# EAGLE design esp32cam (EAGLE 9.6.2)
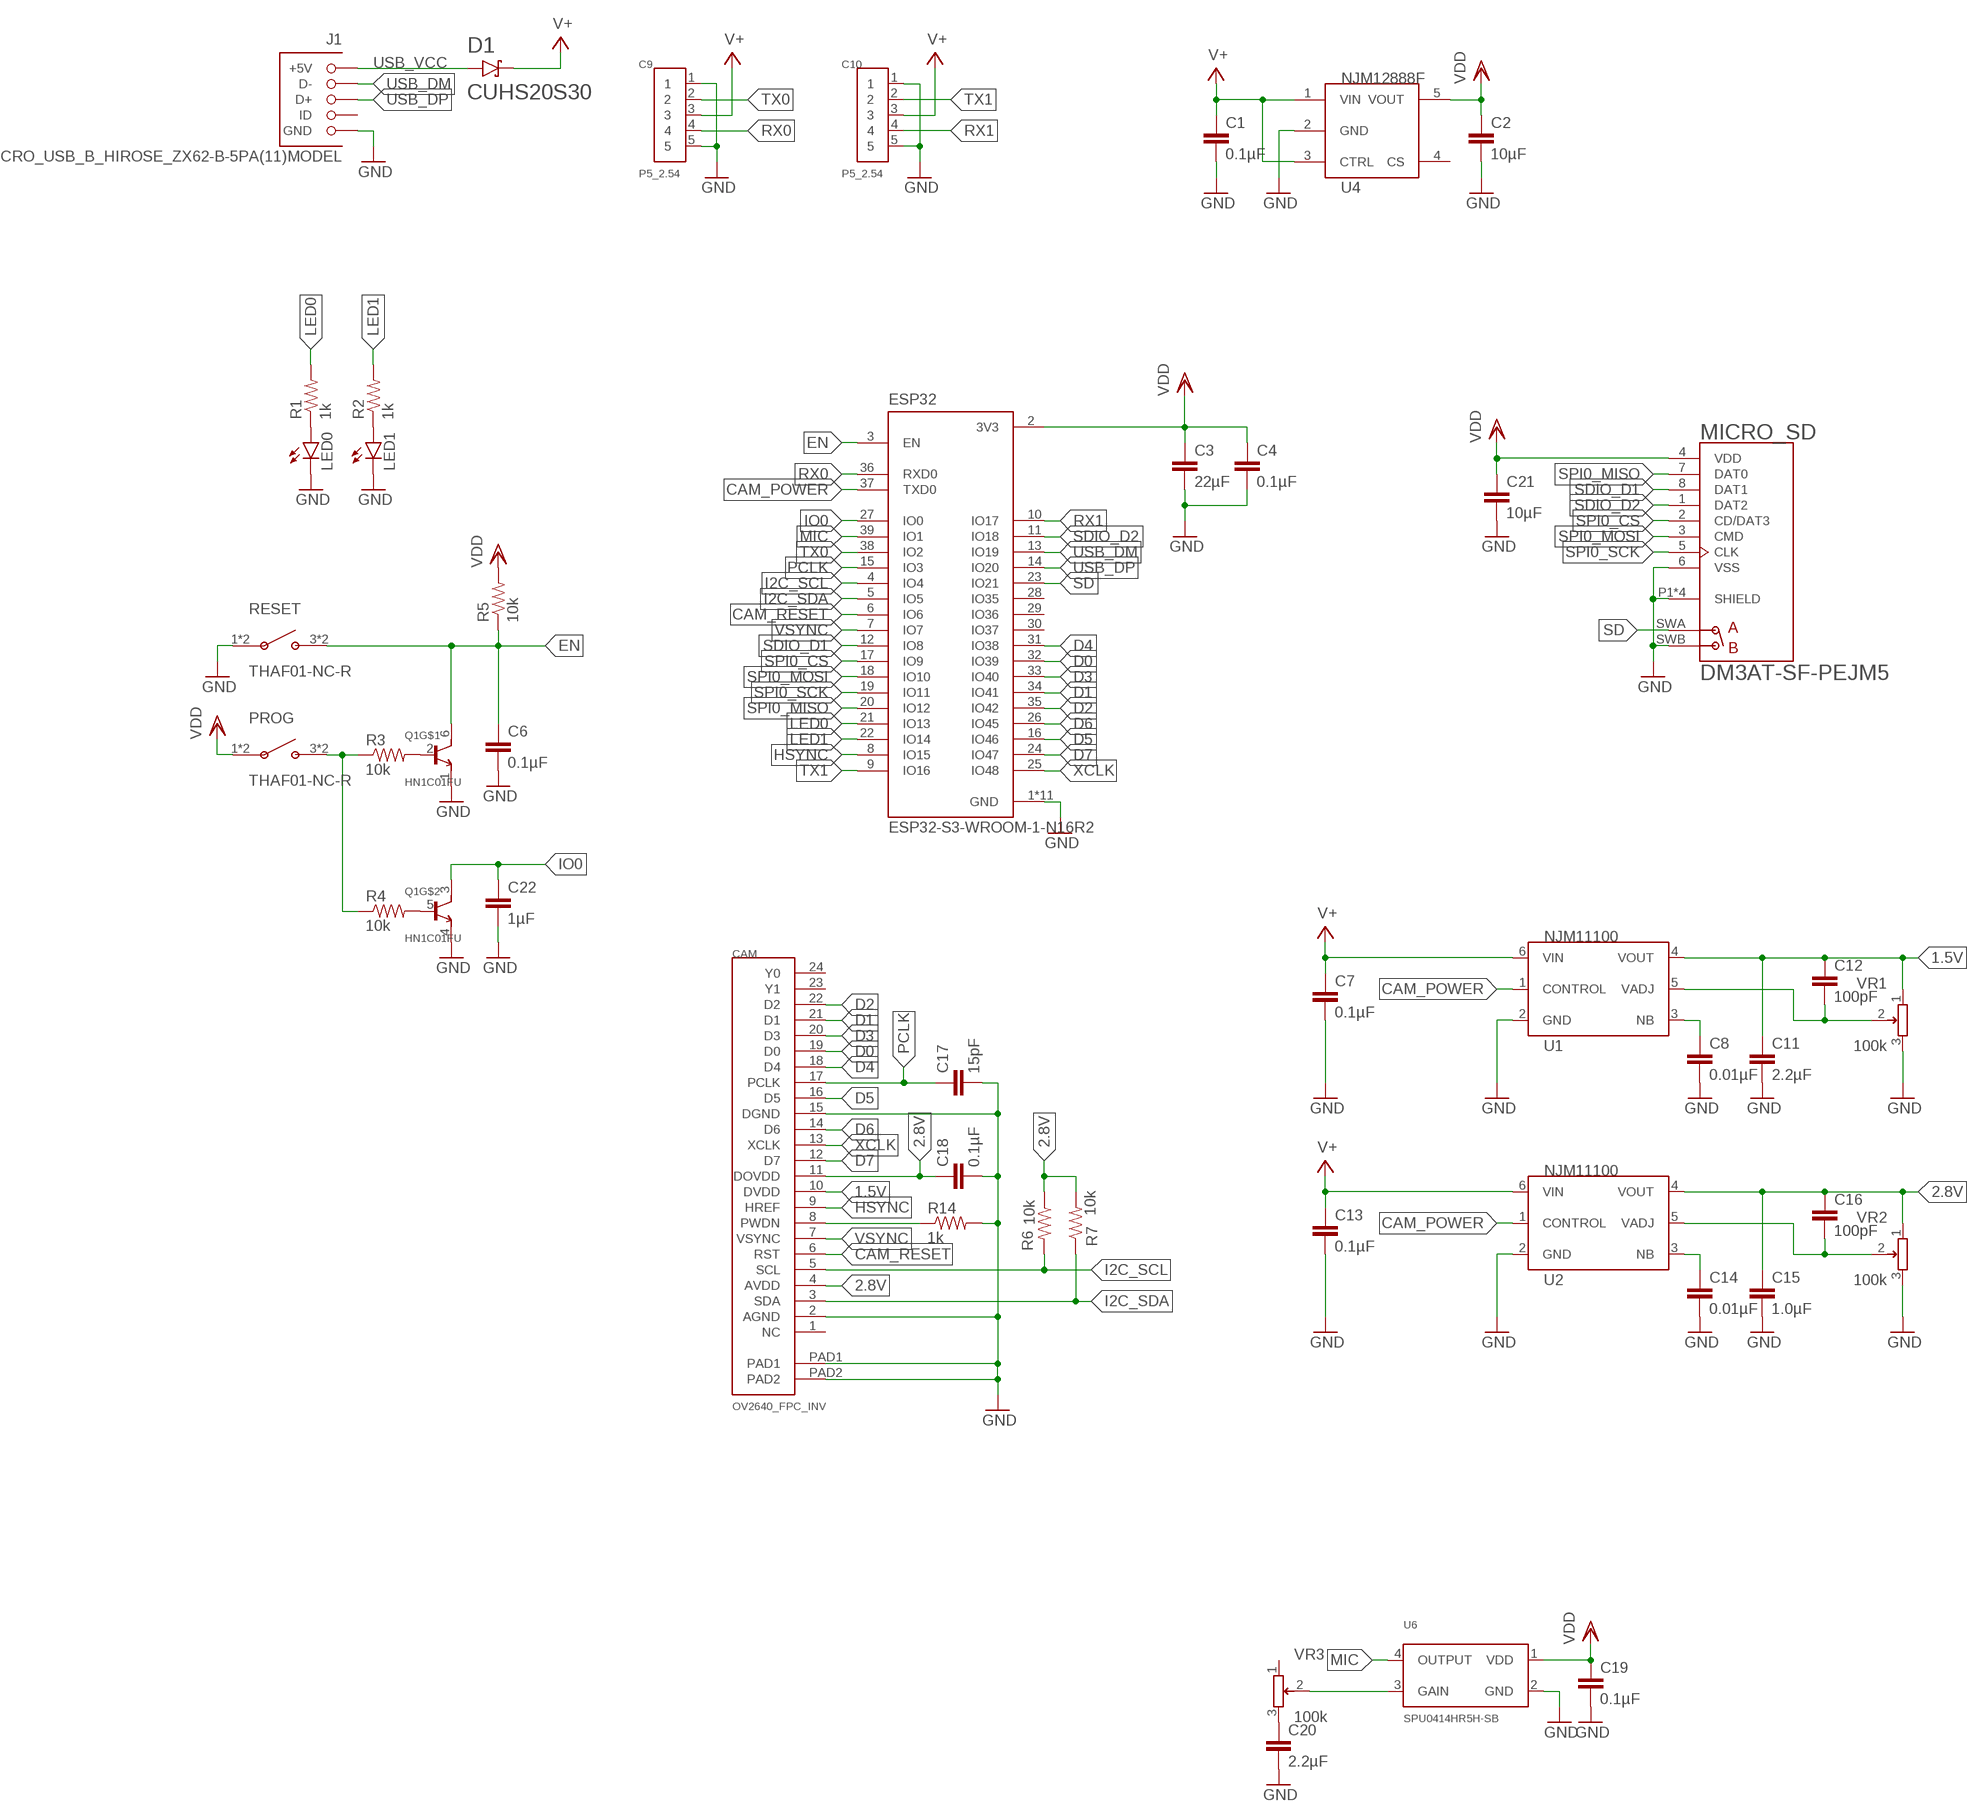
[diagram p0: schematic, sheet 1]

## Parts
C1  0.1µF  C-EUC0402  [C0402]
C2  10µF  C-EUC0402  [C0402]
C3  22µF  C-EUC0402  [C0402]
C4  0.1µF  C-EUC0402  [C0402]
C6  0.1µF  C-EUC0402  [C0402]
C7  0.1µF  C-EUC0402  [C0402]
C8  0.01µF  C-EUC0402  [C0402]
C9  P5_2.54  [P5_2.54]
C10  P5_2.54  [P5_2.54]
C11  2.2µF  C-EUC0402  [C0402]
C12  100pF  C-EUC0402  [C0402]
C13  0.1µF  C-EUC0402  [C0402]
C14  0.01µF  C-EUC0402  [C0402]
C15  1.0µF  C-EUC0402  [C0402]
C16  100pF  C-EUC0402  [C0402]
C17  15pF  C-EUC0402  [C0402]
C18  0.1µF  C-EUC0402  [C0402]
C19  0.1µF  C-EUC0402  [C0402]
C20  2.2µF  C-EUC0402  [C0402]
C21  10µF  C-EUC0402  [C0402]
C22  1µF  C-EUC0402  [C0402]
CAM  OV2640_FPC_INV  [FH12-24S-0.5SH]
D1  CUHS20S30  [CUHS20S30]
ESP32  ESP32-S3-WROOM-1-N16R2  [XCVR_ESP32-S3-WROOM-1-N16R2]
J1  MICRO_USB_B_HIROSE_ZX62-B-5PA(11)MODEL  [GHI-CONNECTORS_10118192-0001LF(MICRO-USB-B-AMPHENOL-FCI)]
LED0  LEDCHIPLED_0603  [CHIPLED_0603]
LED1  LEDCHIPLED_0603  [CHIPLED_0603]
MICRO_SD  DM3AT-SF-PEJM5  [HRS_DM3AT-SF-PEJM5]
PROG  THAF01-NC-R  [THAF01-NC-R]
Q1  HN1C01FU  [SOT-363]
R1  1k  R-US_R0402  [R0402]
R2  1k  R-US_R0402  [R0402]
R3  10k  R-US_R0402  [R0402]
R4  10k  R-US_R0402  [R0402]
R5  10k  R-US_R0402  [R0402]
R6  10k  R-US_R0402  [R0402]
R7  10k  R-US_R0402  [R0402]
R14  1k  R-US_R0402  [R0402]
RESET  THAF01-NC-R  [THAF01-NC-R]
U1  NJM11100  [SOT95P240X110-6N]
U2  NJM11100  [SOT95P240X110-6N]
U4  NJM12888F  [SOT95P240X110-5N]
U6  SPU0414HR5H-SB  [SPU0414HR5H-SB]
VR1  100k  PVZ3A  [PVZ3A]
VR2  100k  PVZ3A  [PVZ3A]
VR3  100k  PVZ3A  [PVZ3A]

## Nets
1.5V: C11.1 C12.1 CAM.10(DVDD) U1.4(VOUT) VR1.1
2.8V: C15.1 C16.1 C18.1 CAM.4(AVDD) CAM.11(DOVDD) R6.1 R7.2 U2.4(VOUT) VR2.1
CAM_POWER: ESP32.37(TXD0) U1.1(CONTROL) U2.1(CONTROL)
CAM_RESET: CAM.6(RST) ESP32.6(IO6)
D0: CAM.19(D0) ESP32.32(IO39)
D1: CAM.21(D1) ESP32.34(IO41)
D2: CAM.22(D2) ESP32.35(IO42)
D3: CAM.20(D3) ESP32.33(IO40)
D4: CAM.18(D4) ESP32.31(IO38)
D5: CAM.16(D5) ESP32.16(IO46)
D6: CAM.14(D6) ESP32.26(IO45)
D7: CAM.12(D7) ESP32.24(IO47)
EN: C6.1 ESP32.3(EN) Q1.6(C) R5.1 RESET.3(B) RESET.4(B)
GND: C1.2 C2.2 C3.2 C4.2 C6.2 C7.2 C8.2 C9.1 C9.5 C10.1 C10.5 C11.2 C13.2 C14.2 C15.2 C17.2 C18.2 C19.2 C20.2 C21.2 C22.2 CAM.2(AGND) CAM.15(DGND) CAM.PAD1 CAM.PAD2 ESP32.1(GND) ESP32.40(GND) ESP32.41_1(GND) ESP32.41_2(GND) ESP32.41_3(GND) ESP32.41_4(GND) ESP32.41_5(GND) ESP32.41_6(GND) ESP32.41_7(GND) ESP32.41_8(GND) ESP32.41_9(GND) J1.CGND1(GND) J1.CGND2(GND) J1.CGND3(GND) J1.CGND4(GND) J1.CGND5(GND) J1.CGND6(GND) J1.GND LED0.C LED1.C MICRO_SD.6(VSS) MICRO_SD.P1(SHIELD) MICRO_SD.P2(SHIELD) MICRO_SD.P3(SHIELD) MICRO_SD.P4(SHIELD) MICRO_SD.SWB(B) Q1.1(E) Q1.4(E) R14.2 RESET.1(A) RESET.2(A) U1.2(GND) U2.2(GND) U4.2(GND) U6.2(GND) VR1.3 VR2.3
HSYNC: CAM.9(HREF) ESP32.8(IO15)
I2C_SCL: CAM.5(SCL) ESP32.4(IO4) R6.2
I2C_SDA: CAM.3(SDA) ESP32.5(IO5) R7.1
IO0: C22.1 ESP32.27(IO0) Q1.3(C)
LED0: ESP32.21(IO13) R1.2
LED1: ESP32.22(IO14) R2.2
MIC: ESP32.39(IO1) U6.4(OUTPUT)
N$1: C8.1 U1.3(NB)
N$2: C12.2 U1.5(VADJ) VR1.2
N$3: C14.1 U2.3(NB)
N$4: C16.2 U2.5(VADJ) VR2.2
N$5: PROG.3(B) PROG.4(B) R3.1 R4.1
N$7: LED0.A R1.1
N$8: LED1.A R2.1
N$9: Q1.2(B) R3.2
N$10: CAM.8(PWDN) R14.1
N$11: Q1.5(B) R4.2
N$13: U6.3(GAIN) VR3.2
N$14: C20.1 VR3.3
PCLK: C17.1 CAM.17(PCLK) ESP32.15(IO3)
RX0: C9.4 ESP32.36(RXD0)
RX1: C10.4 ESP32.10(IO17)
SD: ESP32.23(IO21) MICRO_SD.SWA(A)
SDIO_D1: ESP32.12(IO8) MICRO_SD.8(DAT1)
SDIO_D2: ESP32.11(IO18) MICRO_SD.1(DAT2)
SPI0_CS: ESP32.17(IO9) MICRO_SD.2(CD/DAT3)
SPI0_MISO: ESP32.20(IO12) MICRO_SD.7(DAT0)
SPI0_MOSI: ESP32.18(IO10) MICRO_SD.3(CMD)
SPI0_SCK: ESP32.19(IO11) MICRO_SD.5(CLK)
TX0: C9.2 ESP32.38(IO2)
TX1: C10.2 ESP32.9(IO16)
USB_DM: ESP32.13(IO19) J1.D-
USB_DP: ESP32.14(IO20) J1.D+
USB_VCC: D1.A J1.VBUS(+5V)
V+: C1.1 C7.1 C9.3 C10.3 C13.1 D1.C U1.6(VIN) U2.6(VIN) U4.1(VIN) U4.3(CTRL)
VDD: C2.1 C3.1 C4.1 C19.1 C21.1 ESP32.2(3V3) MICRO_SD.4(VDD) PROG.1(A) PROG.2(A) R5.2 U4.5(VOUT) U6.1(VDD)
VSYNC: CAM.7(VSYNC) ESP32.7(IO7)
XCLK: CAM.13(XCLK) ESP32.25(IO48)
Unconnected: CAM.1(NC) CAM.23(Y1) CAM.24(Y0) ESP32.28(IO35) ESP32.29(IO36) ESP32.30(IO37) J1.ID U4.4(CS) VR3.1

## Library data of the parts
C1-C4 C6-C8 C11-C22 = rcl:C-EU: CAPACITOR, European symbol; SPICEPREFIX: C
C9 C10 = pins:P5_2.54
CAM = camera:OV2640_FPC_INV
D1 = diodes:CUHS20S30
ESP32 = ESP32-S3-WROOM-1-N16R2:ESP32-S3-WROOM-1-N16R2: Check availability <https://pricing.snapeda.com/parts/ESP32-S3-WROOM-1-N16R2/Espressif%20Systems/view-part?ref=eda>; AVAILABILITY: In Stock; DESCRIPTION: Bluetooth, WiFi 802.11b/g/n, Bluetooth v5.0 Transceiver Module 2.4GHz PCB Trace Surface Mount; MF: Espressif Systems; MP: ESP32-S3-WROOM-1-N16R2; PACKAGE: None; PRICE: None; PURCHASE-URL: https://pricing.snapeda.com/search/part/ESP32-S3-WROOM-1-N16R2/?ref=eda
J1 = connector:MICRO_USB_B_HIROSE_ZX62-B-5PA(11): Connector Receptacle USB - micro B 2.0 5 Position Surface Mount, Right Angle, Horizontal Bottom Mount
LED0 LED1 = led:LED: LED OSRAM: - CHIPLED LG R971, LG N971, LY N971, LG Q971, LY Q971, LO R971, LY R971 LH N974, LH R974 LS Q976, LO Q976, LY Q976 LO Q996 - Hyper CHIPLED LW Q18S LB Q993, LB Q99A, LB R99A - SideLED LS A670, LO A670, LY A670, LG A670, LP A670 LB A673, LV A673, LT A673, LW A673 LH A674 LY A675 LS A676, LA A676, LO A676, LY A676, LW A676 LS A679, LY A679, LG A679 - Hyper Micro SIDELED® LS Y876, LA Y876, LO Y876, LY Y876 LT Y87S - SmartLED LW L88C, LW L88S LB L89C, LB L89S, LG L890 LS L89K, LO L89K, LY L89K LS L896, LA L896, LO L896, LY L896 - TOPLED LS T670, LO T670, LY T670, LG T670, LP T670 LSG T670, LSP T670, LSY T670, LOP T670, LYG T670 LG T671, LOG T671, LSG T671 LB T673, LV T673, LT T673, LW T673 LH T674 LS T676, LA T676, LO T676, LY T676, LB T676, LH T676, LSB T676, LW T676 LB T67C, LV T67C, LT T67C, LS T67K, LO T67K, LY T67K, LW E67C LS E67B, LA E67B, LO E67B, LY E67B, LB E67C, LV E67C, LT E67C LW T67C LS T679, LY T679, LG T679 LS T770, LO T770, LY T770, LG T770, LP T770 LB T773, LV T773, LT T773, LW T773 LH T774 LS E675, LA E675, LY E675, LS T675 LS T776, LA T776, LO T776, LY T776, LB T776 LHGB T686 LT T68C, LB T68C - Hyper Mini TOPLED® LB M676 - Mini TOPLED Santana® LG M470 LS M47K, LO M47K, LY M47K Source: http://www.osram.convergy.de LUXEON: - LUMILED® LXK2-PW12-R00, LXK2-PW12-S00, LXK2-PW14-U00, LXK2-PW14-V00 LXK2-PM12-R00, LXK2-PM12-S00, LXK2-PM14-U00 LXK2-PE12-Q00, LXK2-PE12-R00, LXK2-PE12-S00, LXK2-PE14-T00, LXK2-PE14-U00 LXK2-PB12-K00, LXK2-PB12-L00, LXK2-PB12-M00, LXK2-PB14-N00, LXK2-PB14-P00, LXK2-PB14-Q00 LXK2-PR12-L00, LXK2-PR12-M00, LXK2-PR14-Q00, LXK2-PR14-R00 LXK2-PD12-Q00, LXK2-PD12-R00, LXK2-PD12-S00 LXK2-PH12-R00, LXK2-PH12-S00 LXK2-PL12-P00, LXK2-PL12-Q00, LXK2-PL12-R00 Source: www.luxeon.com KINGBRIGHT: KA-3528ASYC Source: www.kingbright.com
MICRO_SD = dm3at-sf-pejm5:DM3AT-SF-PEJM5: DM3 Series 8 Position Right Angle SMT Push Push Ejection MicroSD Card Connector; DESCRIPTION: DM3 RA SMT microSD memory card push/push; DIGI-KEY_PART_NUMBER: HR1964CT-ND; DIGI-KEY_PURCHASE_URL: https://www.digikey.jp/product-detail/en/hirose-electric-co-ltd/DM3AT-SF-PEJM5/HR1964CT-ND/2533566?utm_source=snapeda&utm_medium=aggregator&utm_campaign=symbol; MF: Hirose; MP: DM3AT-SF-PEJM5; PACKAGE: None
PROG RESET = switches:THAF01-NC-R
Q1 = transistors:HN1C01FU
R1-R7 R14 = rcl:R-US_: RESISTOR, American symbol; SPICEPREFIX: R
U1 U2 = regulators:NJM11100
U4 = regulators:NJM12888F
U6 = microphones:SPU0414HR5H-SB
VR1-VR3 = potentiometers:PVZ3A

## Board
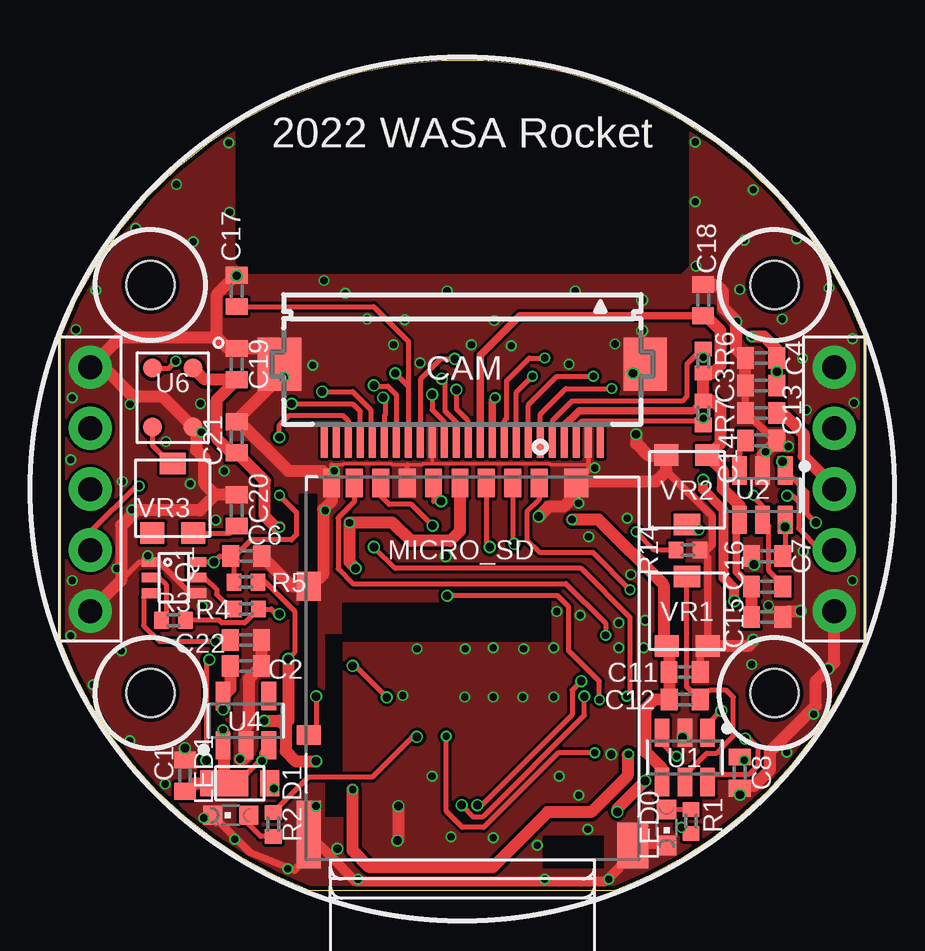
[diagram p1: board, top side]
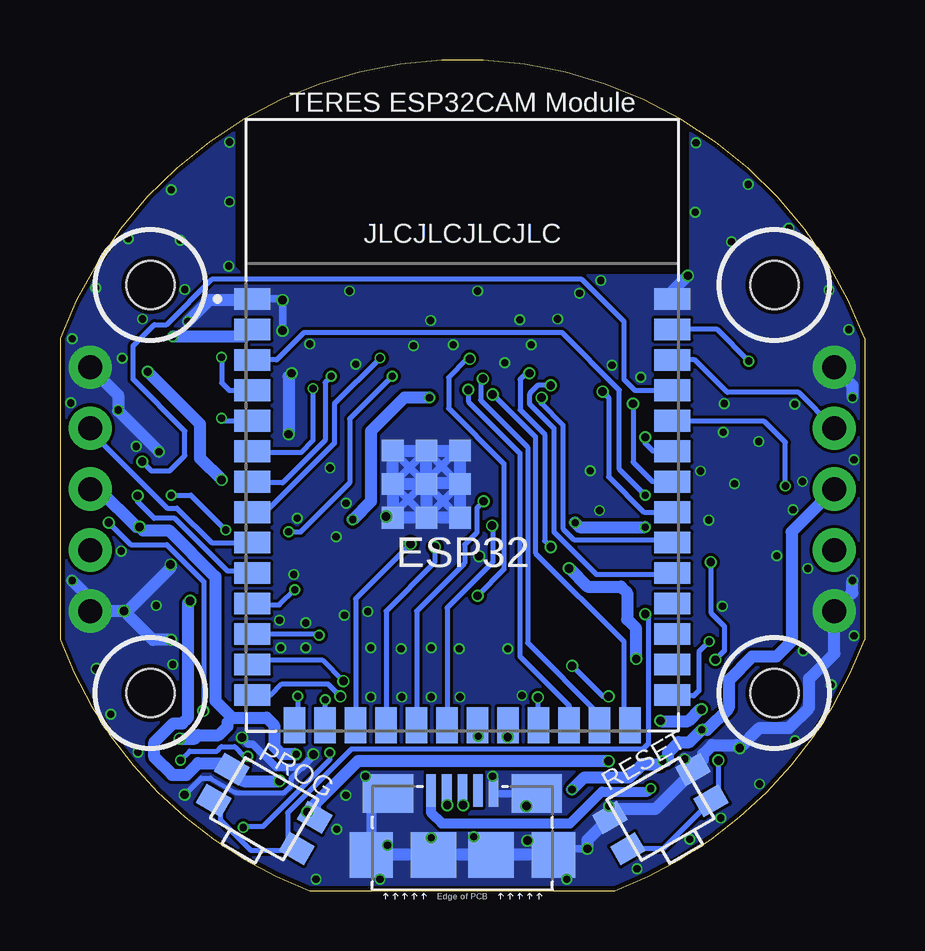
[diagram p2: board, bottom side, seen from below]

Size 33.53 x 34.61 mm. Coordinates in mm from the lower left corner, seen from the top.
Outline: 33.53,23.01 33.53,10.46 arc-49 23.11,0 10.41,0 arc-49 0,10.46 0,23.01 arc-139 33.53,23.01
Copper layers (1*16): Top 0.035mm / dielectric 1mm / Bottom 0.035mm
Design rules "jlcpcb-2layers-1.0mm": minimum track width 5mil, minimum drill 0.3mm, track to track 5mil, track to pad 5mil, pad to pad 5mil, via to via 5mil, smd to smd 5mil, copper to edge 0.2mm, drill to drill 6mil, minimum pad ring 10mil, minimum via ring 3mil, stop-mask expansion 4mil, vias tented up to drill 1mm, thermal gap 10mil
Holes 2 mm at 29.76,25.24 29.76,8.24 3.76,25.24 3.76,8.24

### Footprints (pad centres in the part's own frame; a part is rotated, then mirrored left to right if it is on the bottom)
C0402 = smd 0.7 x 0.9: 1 -0.65,0; 2 0.65,0
P5_2.54 = drill 1: 1 0,5.08; 2 0,2.54; 3 0,0; 4 0,-2.54; 5 0,-5.08
FH12-24S-0.5SH = smd 0.3 x 1.3: 1 -5.75,3.25; 2 -5.25,3.25; 3 -4.75,3.25; 4 -4.25,3.25; 5 -3.75,3.25; 6 -3.25,3.25; 7 -2.75,3.25; 8 -2.25,3.25; 9 -1.75,3.25; 10 -1.25,3.25; 11 -0.75,3.25; 12 -0.25,3.25; 13 0.25,3.25; 14 0.75,3.25; 15 1.25,3.25; 16 1.75,3.25; 17 2.25,3.25; 18 2.75,3.25; 19 3.25,3.25; 20 3.75,3.25; 21 4.25,3.25; 22 4.75,3.25; 23 5.25,3.25; 24 5.75,3.25 | smd 1.8 x 2.2: PAD1 -7.62,0; PAD2 7.62,0
CUHS20S30 = smd 0.8 x 1.1: A 1.25,0 | smd 2 x 1.1: C -0.65,0
XCVR_ESP32-S3-WROOM-1-N16R2 = smd 1.5 x 0.9: 1 -8.75,5.26; 2 -8.75,3.99; 3 -8.75,2.72; 4 -8.75,1.45; 5 -8.75,0.18; 6 -8.75,-1.09; 7 -8.75,-2.36; 8 -8.75,-3.63; 9 -8.75,-4.9; 10 -8.75,-6.17; 11 -8.75,-7.44; 12 -8.75,-8.71; 13 -8.75,-9.98; 14 -8.75,-11.25; 27 8.75,-11.25; 28 8.75,-9.98; 29 8.75,-8.71; 30 8.75,-7.44; 31 8.75,-6.17; 32 8.75,-4.9; 33 8.75,-3.63; 34 8.75,-2.36; 35 8.75,-1.09; 36 8.75,0.18; 37 8.75,1.45; 38 8.75,2.72; 39 8.75,3.99; 40 8.75,5.26 | smd 0.9 x 1.5: 15 -6.985,-12.5; 16 -5.715,-12.5; 17 -4.445,-12.5; 18 -3.175,-12.5; 19 -1.905,-12.5; 20 -0.635,-12.5; 21 0.635,-12.5; 22 1.905,-12.5; 23 3.175,-12.5; 24 4.445,-12.5; 25 5.715,-12.5; 26 6.985,-12.5 | smd 0.9 x 0.9: 41_1 -1.5,-2.46; 41_2 -2.9,-2.46; 41_3 -0.1,-2.46; 41_4 -2.9,-3.86; 41_5 -1.5,-3.86; 41_6 -0.1,-3.86; 41_7 -2.9,-1.06; 41_8 -1.5,-1.06; 41_9 -0.1,-1.06
GHI-CONNECTORS_10118192-0001LF(MICRO-USB-B-AMPHENOL-FCI) = smd 1.8 x 1.9: CGND1 -3.8,0; CGND4 3.8,0 | smd 1.9 x 1.9: CGND2 -1.2,0; CGND3 1.2,0 | smd 2.1 x 1.6: CGND5 3.1,2.55; CGND6 -3.1,2.55 | smd 0.4 x 1.35: D+ 0,2.675; D- -0.65,2.675; GND 1.3,2.675; ID 0.65,2.675; VBUS -1.3,2.675
CHIPLED_0603 = smd 0.8 x 0.8: A 0,-0.75; C 0,0.75
HRS_DM3AT-SF-PEJM5 = smd 0.7 x 1.2: 1 3.2,0; 2 2.1,0; 3 1,0; 4 -0.1,0; 5 -1.2,0; 6 -2.3,0; 7 -3.4,0; 8 -4.5,0; SWB -5.45,0 | smd 1 x 1.2: P1 -6.4,-4.3; P4 4.75,0 | smd 1 x 2.8: P2 -6.4,-14.65 | smd 1.3 x 1.9: P3 7.1,-15.1 | smd 1 x 0.8: SWA -6.4,-10.5
THAF01-NC-R = smd 1.2 x 0.9: 1 -2,0.75; 2 2,0.75; 3 -2,-0.75; 4 2,-0.75
SOT-363 = smd 0.4 x 0.8: 1 -0.65,-0.95; 2 0,-0.95; 3 0.65,-0.95; 4 0.65,0.95; 5 0,0.95; 6 -0.65,0.95
R0402 = smd 0.6 x 0.7: 1 -0.5,0; 2 0.5,0
SOT95P240X110-6N = smd 1.18 x 0.609: 1 -1.024,0.95; 2 -1.024,0; 3 -1.024,-0.95; 4 1.024,-0.95; 5 1.024,0; 6 1.024,0.95
SOT95P240X110-5N = smd 1.18 x 0.609: 1 -1.024,0.95; 2 -1.024,0; 3 -1.024,-0.95; 4 1.024,-0.95; 5 1.024,0.95
SPU0414HR5H-SB = smd 0.8 x 0.8: 1 0.85,1.23; 2 0.85,-1.23; 3 -0.85,-1.23; 4 -0.85,1.23
PVZ3A = smd 1 x 0.9: 1 -0.85,-1.45; 3 0.85,-1.45 | smd 1.1 x 0.9: 2 0,1.45

### Placement (x,y rotation side)
C1  5.21,4.8 90 top
C2  7.75,9.37 0 top
C3  29.21,21.05 180 top
C4  29.21,22.2 180 top
C6  7.76,13.94 0 top
C7  29.46,13.94 180 top
C8  28.32,4.92 270 top
C9  1.26,16.74 0 top
C10  32.26,16.74 0 top
C11  26.02,9.11 0 top
C12  26.03,7.97 0 top
C13  29.21,19.91 180 top
C14  29.21,18.77 0 top
C15  29.46,11.4 0 top
C16  29.46,12.67 0 top
C17  7.37,24.99 90 top
C18  26.8,24.61 90 top
C19  7.37,21.94 90 top
C20  7.37,15.85 90 top
C21  7.37,18.89 90 top
C22  7.75,10.45 0 top
CAM  16.76,21.94 180 top
D1  7.49,4.48 0 top
ESP32  16.76,19.4 0 bottom
J1  16.76,1.5 0 bottom
LED0  25.27,2.64 180 top
LED1  7.11,3.15 90 top
MICRO_SD  16.76,16.99 0 top
PROG  25.02,3.41 330 bottom
Q1  4.75,13.05 270 top
R1  26.29,2.89 270 top
R2  8.89,2.77 90 top
R3  4.73,11.27 180 top
R4  7.76,11.74 180 top
R5  7.75,12.86 0 top
R6  26.8,22.07 90 top
R7  26.8,19.91 90 top
R14  26.16,14.2 0 top
RESET  8.51,3.4 30 bottom
U1  26.04,5.56 270 top
U2  29.27,16.48 270 top
U4  7.75,7.08 90 top
U6  4.7,20.55 0 top
VR1  26.13,11.65 0 top
VR2  26.12,16.7 180 top
VR3  4.7,16.35 0 top

### Tracks (layer width: path | path; a pad name or v marks a point on that pad's centre or on a via)
1.5V  (via drill 0.3)
  Top 0.305: CAM.10 18.01,20.43 v18.13,20.55
  Top 0.508: U1.4 25.09,5.1 24.4,5.78 24.4,7.59 24.78,7.97 C12.1 C11.1 25.38,10.11 VR1.1 25.16,10.33 25.16,12.74 22.43,15.47 v21.34,15.47
  Bottom 0.508: v18.13,20.55 19.18,20.55 20.57,19.15 20.57,16.23 v21.34,15.47
2.8V
  Top 0.2: 21.27,19.59 21.01,19.33 CAM.4
  Top 0.305: R7.2 26.38,19.99 21.63,19.99 21.27,19.62 21.25,19.62 21.01,19.39 CAM.4 | C18.1 19.16,23.96 17.51,22.31 CAM.11 | U2.4 28.32,15.02 28.18,14.89 28.18,13.3 C16.1
  Top 0.508: U2.4 28.32,16.05 27.61,16.76 27.61,17.52 VR2.1 27.03,18.15 27.53,18.65 27.53,20.09 27.21,20.41 R7.2 R6.1 27.21,21.57 27.53,21.89 27.53,23.33 26.9,23.96 C18.1 | C16.1 C15.1 28.81,11.61
CAM_POWER  (via drill 0.35)
  Top 0.2: U1.1 26.98,6.96 27.52,7.49 v27.56,7.49 | v31.5,15.34 31.12,15.72 31.12,16.61 U2.1 30.1,17.63 v30.1,17.88
  Bottom 0.2: v31.5,15.34 30.58,14.42 29.07,14.42 27.53,12.88 27.53,7.52 v27.56,7.49 | v30.1,17.88 29.72,17.5 28.96,17.5 28.32,18.13 28.32,19.15 30.48,21.31 30.48,22.7 29.6,23.59 29.09,23.59 27.18,25.5 11.81,25.5 10.03,23.72 10.03,21.31 9.58,20.85 ESP32.37
CAM_RESET  (via drill 0.3)
  Top 0.2: CAM.6 20.01,19.86 21.08,20.93 v22.99,20.93
  Bottom 0.2: v22.99,20.93 22.99,18.77 23.49,18.26 25.46,18.26 ESP32.6
D0  (via drill 0.35)
  Top 0.2: CAM.19 13.51,19.79 13.56,19.84 13.56,20.45 v13.46,20.55
  Bottom 0.2: v13.46,20.55 13.46,20.33 13.48,20.31 12.57,19.4 12.57,15.08 12.12,14.63 8.14,14.63 ESP32.32
D1  (via drill 0.35)
  Top 0.2: CAM.21 12.51,19.97 12.19,20.29 v9.65,20.29
  Bottom 0.2: v9.65,20.29 9.65,17.86 8.84,17.04 ESP32.34
D2  (via drill 0.35)
  Top 0.2: CAM.22 12.01,19.58 11.81,19.78 9.52,19.78 9.14,19.4 v9.14,18.89
  Bottom 0.2: ESP32.35 8.82,18.31 9.14,18.64 v9.14,18.89
D3  (via drill 0.35)
  Top 0.2: v10.92,20.8 12.19,20.8 12.95,20.04 12.95,18.75 CAM.20
  Bottom 0.2: v10.92,20.8 10.67,20.55 10.67,17.24 9.2,15.77 ESP32.33
D4  (via drill 0.35)
  Top 0.2: v13.08,21.05 13.11,21.02 13.66,21.02 14.01,20.67 CAM.18
  Bottom 0.2: v13.08,21.05 13.63,21.05 13.94,20.74 13.94,20.7 13.97,20.67 13.97,20.29 12.95,19.28 12.95,14.96 11.18,13.18 8.07,13.18 ESP32.31
D5  (via drill 0.3, 0.35)
  Top 0.2: CAM.16 15.01,21.3 15.87,22.16 v16.45,22.16 | v22.48,7.96 22.48,8.72 21.18,10.02 21.18,11.85 20.74,12.29 v16.13,12.29
  Bottom 0.2: v16.13,12.29 15.03,13.39 15.03,17.8 17.34,20.1 17.34,21.38 16.55,22.16 v16.45,22.16 | ESP32.16 v22.48,7.96
D6  (via drill 0.35)
  Top 0.2: v15.5,20.68 15.5,20.04 16,19.54 16,18.7 CAM.14
  Bottom 0.2: v15.5,20.68 15.47,20.68 13.72,18.92 13.72,14.07 10.03,10.39 10.03,7.16 ESP32.26
D7  (via drill 0.35)
  Top 0.2: v16.52,20.87 16.52,20.08 16.99,19.6 16.99,18.72 CAM.12
  Bottom 0.2: v16.52,20.87 16.52,20.38 14.37,18.24 14.37,9.77 12.32,7.72 ESP32.24
EN  (via drill 0.3, 0.35)
  Top 0.2: 7.25,13.09 R5.1 7.24,12.84 7.24,13.82 C6.1 | 7.11,14.01 C6.1 | v9.14,16.48 9.85,15.77 9.85,14.83 9.64,14.62 7.97,14.62 7.29,13.94 C6.1 | 6.98,14.07 C6.1 | Q1.6 v6.41,13.69 6.66,13.94 C6.1 | v6.22,9.62 6.1,9.5 v6.1,5.43
  Bottom 0.2: ESP32.3 24.5,22.12 23.35,23.27 12.63,23.27 10.22,20.86 10.22,17.56 v9.14,16.48 | v6.41,13.69 6.41,11.59 5.84,11.02 5.84,10 v6.22,9.62 | v6.1,5.43 6.1,4.06 RESET.4 8.4,1.75 RESET.3
GND  (via drill 0.3, 0.35)
  Top 0.152: 22.01,17.75 20.44,17.75 20.4,17.79 15.49,17.79 | 15.49,17.79 15.13,17.79 15.09,17.75 14.48,17.75 13.84,17.75 13.8,17.79 11.83,17.79 11.79,17.75 11.3,17.75 11.31,17.74 | CAM.15 15.51,17.81 15.49,17.79 | MICRO_SD.SWB 11.31,17.5 11.31,17.61
  Top 0.2: CAM.2 22.01,17.75 22.01,17.49 MICRO_SD.P4 24.77,16.99 24.83,17.05 | 25.27,18.13 VR2.3 | 25.21,17.43 25.31,17.54 25.31,18.13 25.27,18.13 | MICRO_SD.6 14.48,17 14.48,17.75 | 24.51,18.13 25.27,18.13 | C9.5 3.31,13.7 Q1.1 4.13,13.7 5.46,12.37 5.67,12.37 Q1.4 | 11.3,17.75 11.3,17.51 11.31,17.5
  Top 0.305: C14.2 29.75,18.77 28.64,19.88 28.59,19.88 C13.2 C3.2 | LED1.C 7.9,1.61 9.77,0.85 10.36,1.45 MICRO_SD.P2 | v11.56,1.75 11.26,1.45 | MICRO_SD.P3 LED0.C | CAM.PAD1 24.26,22.07 v24.26,23.34 | C11.2 26.67,9.89 VR1.3 26.98,13.87 R14.2 26.95,14.2 27.17,14.42 27.17,15.6 25.27,17.5 | C8.2 28.33,4.26 v28.33,4
  Top 0.406: MICRO_SD.P2 11.26,1.45 12.3,0.4 22.73,0.4 23.86,1.53 MICRO_SD.P3
  Top 0.508: C18.2 27.34,25.26 27.63,24.98 27.63,24.29 v28.19,23.72 28.16,23.72 28.16,22.59 C4.2 C3.2 | U2.2 29.27,18.16 v29.4,18.29 29.86,18.75 C14.2 | 6.54,23.07 6.54,24.85 7.33,25.64 C17.2 v7.37,25.63 | 6.54,23.07 7.01,22.59 C19.2 8.49,22.59 CAM.PAD2 9.14,21.38 7.37,19.61 C21.2 7.48,19.54 9.52,17.5 10.93,17.5 11.31,17.12 MICRO_SD.SWB 11.31,16.23 10.97,15.88 10.97,13.18 10.82,13.03 10.7,13.03 MICRO_SD.P1 | 6.54,23.07 2.52,23.07 C9.1 1.82,21.82 3.02,20.61 4.25,20.61 U6.2 5.68,19.19 5.68,18.37 6.01,18.03 6.01,16.96 6.48,16.5 | VR1.3 28.69,10.2 28.89,10.4 v28.89,10.45 | 28.8,13.93 C7.2 28.89,13.87 28.89,13.62 v28.92,13.59 | C20.2 6.48,16.5 | C6.2 9.66,12.69 MICRO_SD.P1 | v19.94,15.59 20.35,16 20.99,16 21.51,16.53 MICRO_SD.P4 21.58,17.05 24.83,17.05 25.21,17.43 | C22.2 C2.2 7.86,8.83 7.86,6.93 7.75,6.81 U4.2 7.75,5.59 7.64,5.49 v7.5,5.49 | MICRO_SD.P1 10.11,12.69 | v5.21,5.94 C1.2 | 6.48,16.5 5.83,15.85 3.17,15.85 2.54,15.22 2.54,12.94 C9.5 | v14.1,3.53 14.1,2.13 v14.05,2.09 | 26.02,6.56 26.04,6.57 U1.2 25.95,6.49 v25.95,6.38 | C8.2 28.42,4.37 28.92,4.37 29.59,5.04 29.59,5.81 31.5,7.72 31.5,8.73 v32,9.24 32.26,9.5 C10.5 | v24,19.02 24,18.64 24.51,18.13 25.25,18.13 VR2.3 25.27,17.5 | C15.2 30.37,11.66 v30.86,11.66 | CAM.PAD1 24.26,21.94 v23.88,21.56
  Bottom 0.2: 23.44,5.14 23.9,4.68 23.9,4.38 24.2,4.08 26.2,4.08 27.26,4.7 27.65,4.7 v28.33,4.01 v28.33,4
  Bottom 0.305: J1.GND 15.34,4.05 J1.CGND5 | J1.CGND1 20.55,1.5 | ESP32.41_9 16.99,18.34 19.66,15.67 ESP32.41_4 | ESP32.41_7 18.3,16.98 ESP32.41_6 | v11.56,1.75 12.71,1.75 J1.CGND4 | ESP32.1 24.31,24.66 v24.26,24.61 v24.26,23.34 | J1.CGND6 19.86,4.17 20.14,4.44 | v25.95,6.38 25.68,6.11 25.49,6.11 24.52,5.14 23.44,5.14 22.97,5.62 v22.97,5.68 | ESP32.41_8 ESP32.41_3 ESP32.41_5 ESP32.41_2 ESP32.41_8
  Bottom 0.406: J1.CGND6 20.56,3.35 J1.CGND1
  Bottom 0.508: J1.CGND6 19.75,4.05 | J1.CGND2 18.02,1.5 | C10.1 31.1,20.66 v31.1,20.03 31.1,20 v29.4,18.29 | v33.02,12.93 32.26,12.17 C10.5 v30.86,11.66 | C9.1 0.51,21.06 v0.51,20.55 | v0.51,12.93 0.51,12.41 C9.5 1.26,9.88 2.31,8.84 2.31,7.63 3.16,6.78 4.37,6.78 v5.21,5.94 5.33,6.07 6.35,6.07 6.73,5.69 6.73,5.47 RESET.2 | ESP32.1 25.57,24.6 27.31,24.6 v28.19,23.72 | v28.92,13.59 28.92,13.47 30.73,11.66 v30.86,11.66 | RESET.2 7.15,5.14 v7.5,5.49 | RESET.2 7.15,4.98 8.74,3.4 10.27,3.4 RESET.1 11.56,2.11 v11.56,1.75 | v14.05,2.09 13.56,2.09 J1.CGND4 J1.CGND3 J1.CGND2 | J1.CGND5 14.1,3.61 v14.1,3.53 | v28.89,10.45 29.66,10.45 v30.86,11.66 | v23.88,21.56 24,21.43 v24,19.02 | ESP32.41_2 19.66,15.87 v19.94,15.59 19.89,15.54 ESP32.41_5 | ESP32.41_2 ESP32.41_7 ESP32.41_8 | ESP32.41_8 ESP32.41_9 ESP32.41_3 | ESP32.41_3 ESP32.41_6 ESP32.41_5 | J1.CGND2 J1.CGND1 | ESP32.40 8.01,24.98 v7.37,25.63 | ESP32.41_3 16.9,16.98 18.3,16.98 | ESP32.41_1 ESP32.41_2 | ESP32.41_1 ESP32.41_8 | ESP32.41_1 ESP32.41_5
  other vias: 16.07,13.94 33.08,20.33 33.02,23 32.04,25.11 30.69,27.16 28.89,29.21 26.47,31.19 26.47,28.71 26.5,26.03 28.32,25.05 28.51,27.1 30.09,23.82 30.94,22.19 30.35,18.51 30.97,14.15 29.52,11.88 28.83,9.43 31.41,7.35 30.28,5.77 22.86,0.48 20.19,0.48 12.42,0.48 9.49,0.92 7.28,2.15 10.67,3.53 5.99,3.03 4.38,4.45 2.9,6.25 1.39,8.58 2.56,9.99 0.45,10.62 2.37,13.43 0.45,17.96 2.59,17.05 2.92,20.27 5.86,20.3 2.98,15.88 5.93,11.85 3.66,13.96 6.49,15.44 6.84,17.49 5.9,19.1 4.42,18.72 5.42,16.96 0.67,23.38 1.49,25.02 3.16,27.6 4.86,29.43 7.03,31.16 7.06,28.26 5.55,27.04 11,25.43 9.33,21.4 10.53,21.9 12.79,23.82 11.88,24.89 14.37,23.79 18.09,23.76 21.46,24.99 16.13,24.99 18.8,22.7 17.14,22.75 15,22 13.9,22.75 11.43,17.5 11.05,15.85 21.21,21.94 23.13,22.78 23.64,15.52 22.28,17.62 21.61,16.14 22.02,14.75 23.79,13.18 24.38,11.27 21.68,11.48 20.7,11.63 23.28,11.16 14.87,10.09 16.89,10.09 16.86,8.07 14.28,8.14 18.06,8.07 19.28,8.07 20.58,8.07 19.32,10.09 18.06,10.12 20.58,10.12 15.5,4.77 20.8,4.77 21.61,3.98 18.06,2.21 16.29,2.25 19.88,1.9 21.99,2.56 23.28,10.12 24.32,10.12
  pour Bottom (no thermals): 7.24,25.88 7.24,33.5 -2.16,24.1 -2.16,8.1 8.25,-2.31 25.65,-2.31 36.2,8.23 36.2,23.34 35.94,23.59 35.94,23.72 26.29,33.37 26.29,26.01 25.91,25.63 7.49,25.63
  pour Top (no thermals): 7.24,36.04 7.24,26.13 7.75,25.63 25.91,25.63 26.29,26.01 26.29,35.53 38.1,23.72 38.1,9.37 27.3,-1.43 27.3,-1.81 4.7,-1.81 4.32,-2.19 4.32,0.73 -4.95,10 -4.95,23.85
HSYNC  (via drill 0.3)
  Top 0.2: CAM.9 18.51,19.58 18.59,19.66 18.59,21.23 19.56,22.2 v20.19,22.2
  Bottom 0.2: v20.19,22.2 22.1,20.29 22.1,18.64 24.97,15.77 ESP32.8
I2C_SCL  (via drill 0.3)
  Top 0.2: CAM.5 20.51,19.59 21.33,20.4 25.93,20.4 26.12,20.59 26.12,21.94 26.75,22.57 R6.2 v26.8,22.23
  Bottom 0.2: ESP32.4 26.48,20.85 26.8,21.16 v26.8,22.23
I2C_SDA  (via drill 0.3)
  Top 0.2: CAM.3 21.51,19.33 21.75,19.57 26.64,19.57 R7.1 v26.8,19.68
  Bottom 0.2: ESP32.5 26.7,19.59 v26.8,19.68
IO0  (via drill 0.3)
  Top 0.2: Q1.3 3.67,12.4 3.48,12.21 3.48,11.05 4.15,10.39 v6.48,10.39 6.54,10.45 C22.1
  Bottom 0.2: ESP32.27 7.98,8.11 7.12,8.11 6.91,8.33 6.91,9.95 v6.48,10.39
LED0  (via drill 0.3)
  Top 0.2: R1.2 26.04,2.64 v25.89,2.64 | v22.29,5.75 20.76,5.75 17.65,2.64 16.76,2.64 16.1,3.3 v16.1,6.44
  Bottom 0.2: v25.89,2.64 25.85,2.69 25.06,2.69 22.29,5.46 v22.29,5.75 | v16.1,6.44 16.13,6.44 ESP32.21
LED1  (via drill 0.35)
  Top 0.2: R2.2 10.35,4.73 13.02,4.73 14.69,6.41 v14.87,6.41
  Bottom 0.2: v14.87,6.41 14.86,6.42 ESP32.22
MIC  (via drill 0.3)
  Top 0.2: U6.4 4.53,21.78 v4.83,22.07
  Bottom 0.2: v4.83,22.07 6.15,23.39 ESP32.39
N$1  (via drill 0.3)
  Top 0.2: U1.3 25.09,6.15 25.62,5.61 v25.7,5.61 | C8.1 28.46,5.43 v28.51,5.43
  Bottom 0.2: v28.51,5.43 28.13,5.82 26.98,5.82 26.8,6 26.25,6 25.86,5.61 v25.7,5.61
N$2
  Top 0.2: VR1.2 26.1,13.06 26.1,8.52 26.64,7.97 C12.2 27.06,8.35 27.77,8.35 28.06,8.07 28.06,6.44 27.36,5.74 26.95,5.74 26.04,4.82 U1.5
N$3
  Top 0.2: C14.1 28.32,18.53 U2.3
N$4  (via drill 0.3)
  Top 0.2: U2.5 29.27,15.17 | C16.2 30.11,12.76 29.54,13.33 29.54,15.19 U2.5 | VR2.2 26.12,15.28 26.37,15.28 v26.62,15.03 | U2.5 29.27,16.03 28.9,16.41 v28.9,16.48
  Bottom 0.2: v28.9,16.48 28.07,16.48 v26.62,15.03
N$5  (via drill 0.35)
  Top 0.2: R3.1 6.63,11.27 6.74,11.16 7.69,11.16 R4.1 8.81,11.74 9.02,11.53 v9.14,11.53
  Bottom 0.2: PROG.3 26.83,3.47 26.83,2.93 25.57,1.67 23.75,1.67 PROG.4 24.04,2.14 24.04,3.25 21.39,5.9 12.42,5.9 9.25,5.9 9.02,6.13 9.02,11.4 v9.14,11.53 | PROG.3
N$7
  Top 0.2: LED0.A R1.1
N$8
  Top 0.2: R2.1 8.36,2.27 7.86,2.77 LED1.A
N$9
  Top 0.2: 4.23,11.14 R3.2 4.42,11.47 4.42,12.76 4.14,13.05 Q1.2
N$10  (via drill 0.3)
  Top 0.2: CAM.8 19.01,20.76 v19.68,21.43 | R14.1 24.77,14.2 v24,14.96
  Bottom 0.2: v24,14.96 23.49,14.96 21.46,16.99 21.46,19.66 v19.68,21.43
N$11
  Top 0.2: Q1.5 6.04,13.05 6.52,12.56 6.52,12.35 7.14,11.74 R4.2
N$13
  Top 0.2: U6.3 3.85,18.55 4.6,17.8 VR3.2
N$14
  Top 0.2: VR3.3 7.07,14.9 C20.1
PCLK  (via drill 0.3, 0.35)
  Top 0.2: C17.1 13.06,24.34 14.51,22.89 14.51,21.05 | 14.51,21.05 CAM.17 | v13.97,21.56 14.48,21.05 14.51,21.05 | v23.62,8.1 23.75,8.23 23.75,11.4 21.72,13.43 13.97,13.43 v13.08,14.32
  Bottom 0.2: v13.97,21.56 14.1,21.56 14.35,21.31 14.35,20.04 13.33,19.02 13.33,14.58 v13.08,14.32 | v23.62,8.1 23.62,7.03 ESP32.15
RX0  (via drill 0.3)
  Top 0.2: v3.3,16.86 3.17,16.86 1.26,14.96 C9.4
  Bottom 0.2: ESP32.36 4.21,19.58 3.3,18.68 v3.3,16.86
RX1  (via drill 0.35)
  Top 0.2: v30.29,16.46 30.52,16.46 30.77,16.21 30.77,15.11 31.69,14.2 C10.4
  Bottom 0.2: ESP32.10 25.6,13.32 26.55,13.32 28.75,15.52 29.6,15.52 30.29,16.21 v30.29,16.46
SD  (via drill 0.35)
  Top 0.2: v12.19,9.37 12.3,9.37 v13.61,8.06 | v10.67,8.1 10.67,6.79 MICRO_SD.SWA
  Bottom 0.2: ESP32.23 13.61,6.93 v13.61,8.06 | v12.19,9.37 10.92,8.1 v10.67,8.1
SDIO_D1  (via drill 0.3)
  Top 0.2: MICRO_SD.8 12.26,16.22 11.58,15.54 11.58,13.41 12.19,12.8 21.08,12.8 22.73,11.15 v22.73,10.64
  Bottom 0.2: v22.73,10.64 22.73,10.69 ESP32.12
SDIO_D2  (via drill 0.3)
  Top 0.2: v23.75,12.54 22.2,14.1 19.99,14.1 19.46,14.63 19.46,15.79 19.96,16.3 MICRO_SD.1
  Bottom 0.2: ESP32.11 25.46,11.91 24.38,11.91 v23.75,12.54
SPI0_CS  (via drill 0.35)
  Top 0.2: MICRO_SD.2 18.86,14.45 v18.92,14.45
  Bottom 0.2: ESP32.17 21.21,12.16 v18.92,14.45
SPI0_MISO  (via drill 0.35)
  Top 0.2: MICRO_SD.7 13.36,16.45 13.72,16.1 14.64,16.1 v15.53,15.21
  Bottom 0.2: ESP32.20 17.4,11.78 15.49,13.69 15.49,15.18 v15.53,15.21
SPI0_MOSI  (via drill 0.35)
  Top 0.2: MICRO_SD.3 17.76,14.32 v17.91,14.32
  Bottom 0.2: ESP32.18 19.94,11.66 17.91,13.69 v17.91,14.32
SPI0_SCK  (via drill 0.35)
  Top 0.2: MICRO_SD.5 15.56,16.23 v15.88,16.23
  Bottom 0.2: v15.88,16.23 16.16,15.94 16.16,14.92 16.67,14.42 16.67,13.66 18.67,11.66 ESP32.19
TX0
  Bottom 0.2: C9.2 2.76,20.77 5.72,20.77 7.08,22.12 ESP32.38
TX1
  Bottom 0.2: C10.2 32.26,19.15 29.06,15.95 28.66,15.95 27.21,14.5 ESP32.9
USB_DM  (via drill 0.35)
  Top 0.2: v21.72,8.73 21.34,8.36 21.34,7.34 17.56,3.57 v17.39,3.57
  Bottom 0.2: J1.D- 17.41,3.59 v17.39,3.57 | v21.72,8.73 22.61,9.62 25.31,9.62 ESP32.13
USB_DP  (via drill 0.35)
  Top 0.2: v16.73,3.57 16.73,3.55 17.2,3.09 17.63,3.09 21.84,7.3 v21.84,8.1
  Bottom 0.2: J1.D+ 16.76,3.6 v16.73,3.57 | ESP32.14 24.75,8.15 24.28,8.62 22.37,8.62 v21.84,8.1
USB_VCC  (via drill 0.3)
  Top 0.406: D1.A 8.92,4.3 v8.92,4.26
  Bottom 0.406: J1.VBUS 18.07,3.25 17.63,2.81 12.27,2.81 10.95,4.13 9.05,4.13 v8.92,4.26
V+  (via drill 0.3, 0.35)
  Top 0.2: U4.1 6.83,6.1 | 8.66,6.1 U4.3 | v6.79,6.7 | U4.3 8.41,5.78 v8.41,5.41 | v30.21,15.16 v30.22,15.17 U2.6 30.22,14.05 C7.1 | U4.3 8.66,6.02 8.66,5.76 7.38,4.48 D1.C | v28.55,6.34 28.72,6.34 29.08,5.97 29.08,5.22 28.72,4.85 27.3,4.85 U1.6
  Top 0.508: C1.1 5.31,4.15 5.64,4.48 D1.C 6.84,6.01 U4.1 v6.8,6.7 v6.79,6.7 | v23.68,5.69 23.65,5.65 23.65,4.8 22.13,3.27 20.32,3.27 18.03,0.99 12.88,0.99 12.19,1.68 v12.19,4.22 | C13.1 30.1,19.91 30.98,19.03 30.98,18.11 32.26,16.83 C10.3
  Bottom 0.508: C9.3 3.05,14.95 3.05,10.39 3.68,9.75 4.7,9.75 5.67,8.78 5.67,7.61 6.57,6.7 v6.79,6.7 7.3,6.2 7.75,6.2 8.19,5.76 8.19,5.48 8.25,5.41 v8.41,5.41 8.55,5.28 9.27,5.28 9.82,4.73 11.68,4.73 v12.19,4.22 | 26.35,7.21 27.05,7.91 27.05,13.09 28.98,15.02 30.07,15.02 v30.21,15.16 30.34,15.16 31.91,16.74 C10.3 | 26.35,7.21 24.92,7.21 24.61,6.89 24.61,6 24.29,5.69 v23.68,5.69 | v28.55,6.34 27.91,6.34 27.92,6.35 27.78,6.48 26.91,6.48 26.55,6.85 26.55,7.02 26.35,7.21
VDD  (via drill 0.3, 0.35)
  Top 0.2: 8.04,12.86 R5.2 8.57,12.86 9.78,11.66 9.78,9.92 v9.52,9.66
  Top 0.406: v26.8,17.12 26.8,16.72 27.65,15.86 27.65,13.03 28.1,12.58 v28.1,12.07
  Top 0.508: C2.1 7.1,8.41 U4.5 v6.8,7.56 | v28.83,23.09 29.34,23.09 29.86,22.56 C4.1 29.86,21.64 v29.87,21.63 C3.1 | MICRO_SD.4 16.66,14.98 16.26,14.58 14.61,14.58 13.84,15.34 v12.06,15.34 12.06,13.69 v12.32,13.43 | v9.14,15.15 8.98,15.15 8.54,15.59 8.54,17.07 C21.1 7.13,18.24 6.54,18.84 6.54,20.46 C19.1 6.03,21.29 U6.1 | v8.51,7.08 9.14,7.08 9.4,6.83 | v9.52,9.66 9.52,7.09 9.4,7.21 9.4,6.83 | 9.4,6.83 9.4,5.81 9.81,5.4 v10.67,5.4 | v24.38,4.58 23.22,3.42 v23.22,3.29
  Bottom 0.508: ESP32.2 25.82,23.09 v28.83,23.09 | v12.06,15.34 11.87,15.15 v9.14,15.15 | v8.51,7.08 8.49,7.07 7.36,7.07 6.87,7.56 v6.8,7.56 | v10.67,5.4 21.11,5.4 22.91,3.6 PROG.2 | 22.97,3 PROG.2 | v9.52,9.66 9.52,10.93 9.9,11.31 9.9,12.41 10.16,12.67 11.56,12.67 v12.32,13.43 | v29.87,21.63 27.69,19.44 27.69,18.01 v26.8,17.12 | v28.1,12.07 28.19,11.98 28.19,7.21 28.43,6.98 28.81,6.98 29.59,6.19 29.59,5.56 28.86,4.83 28.26,4.83 27.77,5.32 26.63,5.32 PROG.1 25.88,4.56 24.4,4.56 v24.38,4.58 | PROG.2 23,3.06 v23.22,3.29
VSYNC  (via drill 0.3)
  Top 0.2: CAM.7 19.51,20.25 20.7,21.43 v22.23,21.43
  Bottom 0.2: v22.23,21.43 22.48,21.18 22.48,18.77 24.26,16.99 25.46,16.99 ESP32.7
XCLK  (via drill 0.35)
  Top 0.2: v15.91,21.34 16.04,21.21 16.04,20 16.51,19.53 CAM.13
  Bottom 0.2: v15.91,21.34 16,21.24 16,20.44 14.04,18.48 14.04,10.33 11.05,7.34 ESP32.25

### Text on the board
tNames: 2022 WASA Rocket
bNames: TERES ESP32CAM Module | JLCJLCJLCJLC